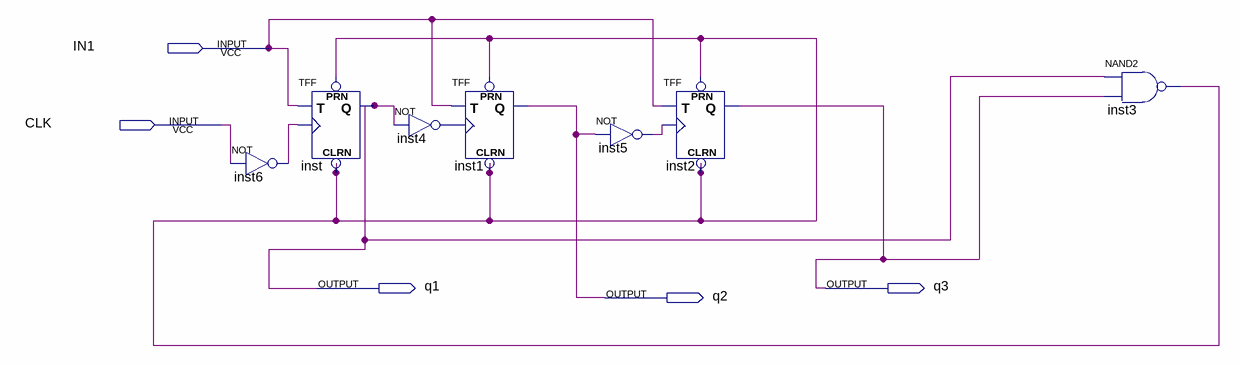
[diagram p0: schematic sheet]
// Quartus schematic demFF1.bdf as structural Verilog: 7 symbols, 5 pins
module demFF1 (
  input  IN1,
  input  CLK,
  output q1,
  output q3,
  output q2
);

  wire inst3_out, inst4_out, inst5_out, inst6_out;

  not inst6 (inst6_out, CLK);
  TFF inst (.PRN(inst3_out), .CLRN(inst3_out), .T(IN1), .CLK(inst6_out), .Q(q1));
  not inst4 (inst4_out, q1);
  TFF inst1 (.PRN(inst3_out), .CLRN(inst3_out), .T(IN1), .CLK(inst4_out), .Q(q2));
  TFF inst2 (.PRN(inst3_out), .CLRN(inst3_out), .T(IN1), .CLK(inst5_out), .Q(q3));
  not inst5 (inst5_out, q2);
  nand inst3 (inst3_out, q1, q3);
endmodule
